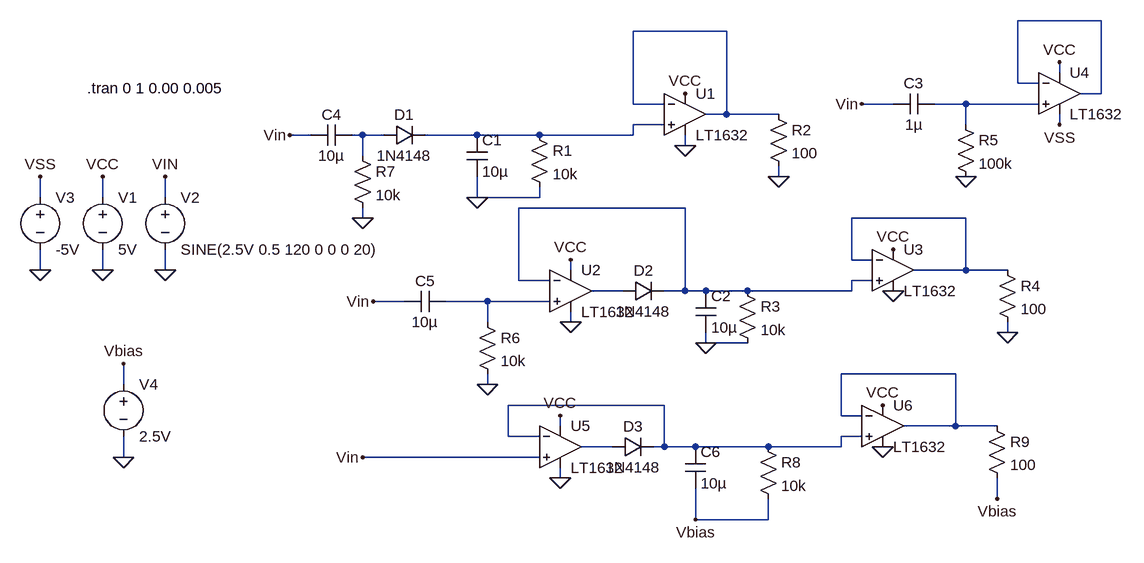
[diagram p0: schematic PeakDetect.asc]
PeakDetect.asc, the LTspice schematic file:
Version 4
SHEET 1 1336 812
WIRE 1296 -144 1168 -144
WIRE 720 -128 576 -128
WIRE 1232 -64 1232 -80
WIRE 1168 -48 1168 -144
WIRE 1200 -48 1168 -48
WIRE 1296 -32 1296 -144
WIRE 1296 -32 1264 -32
WIRE 576 -16 576 -128
WIRE 624 -16 576 -16
WIRE 976 -16 928 -16
WIRE 1088 -16 1040 -16
WIRE 1200 -16 1088 -16
WIRE 720 0 720 -128
WIRE 720 0 688 0
WIRE 800 0 720 0
WIRE 624 16 576 16
WIRE 1088 16 1088 -16
WIRE 1232 16 1232 0
WIRE 80 32 48 32
WIRE 160 32 144 32
WIRE 192 32 160 32
WIRE 336 32 256 32
WIRE 432 32 336 32
WIRE 576 32 576 16
WIRE 576 32 432 32
WIRE 656 48 656 32
WIRE 160 64 160 32
WIRE 800 96 800 80
WIRE -336 128 -336 96
WIRE -240 128 -240 96
WIRE -144 128 -144 96
WIRE 336 128 336 96
WIRE 432 128 432 112
WIRE 432 128 336 128
WIRE 656 144 400 144
WIRE 160 160 160 144
WIRE 1088 160 912 160
WIRE 912 224 912 160
WIRE 944 224 912 224
WIRE -336 240 -336 208
WIRE -240 240 -240 208
WIRE -144 240 -144 208
WIRE 480 240 480 224
WIRE 1088 240 1088 160
WIRE 1088 240 1008 240
WIRE 1152 240 1088 240
WIRE 400 256 400 144
WIRE 448 256 400 256
WIRE 944 256 912 256
WIRE 560 272 512 272
WIRE 656 272 656 144
WIRE 656 272 624 272
WIRE 688 272 656 272
WIRE 752 272 688 272
WIRE 912 272 912 256
WIRE 912 272 752 272
WIRE 224 288 176 288
WIRE 352 288 288 288
WIRE 448 288 352 288
WIRE 352 320 352 288
WIRE 480 320 480 304
WIRE 1152 336 1152 320
WIRE 688 352 688 336
WIRE 752 352 688 352
WIRE 1072 400 896 400
WIRE -208 416 -208 384
WIRE 352 416 352 400
WIRE 624 448 384 448
WIRE 896 464 896 400
WIRE 928 464 896 464
WIRE 464 480 464 464
WIRE 1072 480 1072 400
WIRE 1072 480 992 480
WIRE 1136 480 1072 480
WIRE 384 496 384 448
WIRE 432 496 384 496
WIRE 928 496 896 496
WIRE 544 512 496 512
WIRE 624 512 624 448
WIRE 624 512 608 512
WIRE 672 512 624 512
WIRE 784 512 672 512
WIRE 896 512 896 496
WIRE 896 512 784 512
WIRE -208 528 -208 496
WIRE 432 528 160 528
WIRE 464 560 464 544
WIRE 1136 592 1136 560
WIRE 672 624 672 576
WIRE 784 624 784 592
WIRE 784 624 672 624
FLAG -144 240 0
FLAG -240 240 0
FLAG -144 96 VIN
FLAG -240 96 VCC
FLAG -336 240 0
FLAG -336 96 VSS
FLAG 336 128 0
FLAG 800 96 0
FLAG 656 48 0
FLAG 656 -32 VCC
FLAG 480 320 0
FLAG 480 224 VCC
FLAG 688 352 0
FLAG 1152 336 0
FLAG 976 272 0
FLAG 976 208 VCC
FLAG 48 32 Vin
FLAG 176 288 Vin
FLAG 1232 -80 VCC
FLAG 1232 16 VSS
FLAG 928 -16 Vin
FLAG 1088 96 0
FLAG 352 416 0
FLAG 160 160 0
FLAG 464 560 0
FLAG 464 464 VCC
FLAG 960 512 0
FLAG 960 448 VCC
FLAG 160 528 Vin
FLAG 1136 592 Vbias
FLAG -208 528 0
FLAG -208 384 Vbias
FLAG 672 624 Vbias
SYMBOL voltage -240 112 R0
WINDOW 123 0 0 Left 0
WINDOW 39 0 0 Left 0
SYMATTR InstName V1
SYMATTR Value 5V
SYMBOL voltage -144 112 R0
WINDOW 123 0 0 Left 0
WINDOW 39 0 0 Left 0
SYMATTR InstName V2
SYMATTR Value SINE(2.5V 0.5 120 0 0 0 20)
SYMBOL voltage -336 112 R0
WINDOW 123 0 0 Left 0
WINDOW 39 0 0 Left 0
SYMATTR InstName V3
SYMATTR Value -5V
SYMBOL diode 192 48 R270
WINDOW 0 32 32 VTop 2
WINDOW 3 0 32 VBottom 2
SYMATTR InstName D1
SYMATTR Value 1N4148
SYMBOL cap 320 32 R0
SYMATTR InstName C1
SYMATTR Value 10µ
SYMBOL res 416 16 R0
SYMATTR InstName R1
SYMATTR Value 10k
SYMBOL Opamps\\LT1632 656 -64 R0
SYMATTR InstName U1
SYMBOL res 784 -16 R0
SYMATTR InstName R2
SYMATTR Value 100
SYMBOL diode 560 288 R270
WINDOW 0 32 32 VTop 2
WINDOW 3 0 32 VBottom 2
SYMATTR InstName D2
SYMATTR Value 1N4148
SYMBOL cap 672 272 R0
SYMATTR InstName C2
SYMATTR Value 10µ
SYMBOL res 736 256 R0
SYMATTR InstName R3
SYMATTR Value 10k
SYMBOL Opamps\\LT1632 480 208 R0
SYMATTR InstName U2
SYMBOL Opamps\\LT1632 976 176 R0
SYMATTR InstName U3
SYMBOL res 1136 224 R0
SYMATTR InstName R4
SYMATTR Value 100
SYMBOL cap 144 16 R90
WINDOW 0 0 32 VBottom 2
WINDOW 3 32 32 VTop 2
SYMATTR InstName C4
SYMATTR Value 10µ
SYMBOL Opamps\\LT1632 1232 -96 R0
SYMATTR InstName U4
SYMBOL cap 1040 -32 R90
WINDOW 0 0 32 VBottom 2
WINDOW 3 32 32 VTop 2
SYMATTR InstName C3
SYMATTR Value 1µ
SYMBOL res 1072 0 R0
SYMATTR InstName R5
SYMATTR Value 100k
SYMBOL cap 288 272 R90
WINDOW 0 0 32 VBottom 2
WINDOW 3 32 32 VTop 2
SYMATTR InstName C5
SYMATTR Value 10µ
SYMBOL res 336 304 R0
SYMATTR InstName R6
SYMATTR Value 10k
SYMBOL res 144 48 R0
SYMATTR InstName R7
SYMATTR Value 10k
SYMBOL diode 544 528 R270
WINDOW 0 32 32 VTop 2
WINDOW 3 0 32 VBottom 2
SYMATTR InstName D3
SYMATTR Value 1N4148
SYMBOL cap 656 512 R0
SYMATTR InstName C6
SYMATTR Value 10µ
SYMBOL Opamps\\LT1632 464 448 R0
SYMATTR InstName U5
SYMBOL Opamps\\LT1632 960 416 R0
SYMATTR InstName U6
SYMBOL res 1120 464 R0
SYMATTR InstName R9
SYMATTR Value 100
SYMBOL voltage -208 400 R0
WINDOW 123 0 0 Left 0
WINDOW 39 0 0 Left 0
SYMATTR InstName V4
SYMATTR Value 2.5V
SYMBOL res 768 496 R0
SYMATTR InstName R8
SYMATTR Value 10k
TEXT -264 -40 Left 2 !.tran 0 1 0.00 0.005

The netlist it stands for:
* PeakDetect.asc
V1 VCC 0 5V
V2 VIN 0 SINE(2.5V 0.5 120 0 0 0 20)
V3 VSS 0 -5V
D1 N005 N004 1N4148
C1 N004 0 10µ
R1 N004 0 10k
XU1 N004 N002 VCC 0 N002 LT1632  ; pins In+ In- V+ V- OUT
R2 N002 0 100
D2 N008 N006 1N4148
C2 N006 0 10µ
R3 N006 0 10k
XU2 N009 N006 VCC 0 N008 LT1632  ; pins In+ In- V+ V- OUT
XU3 N006 N007 VCC 0 N007 LT1632  ; pins In+ In- V+ V- OUT
R4 N007 0 100
C4 N005 VIN 10µ
XU4 N003 N001 VCC VSS N001 LT1632  ; pins In+ In- V+ V- OUT
C3 N003 VIN 1µ
R5 N003 0 100k
C5 N009 VIN 10µ
R6 N009 0 10k
R7 N005 0 10k
D3 N012 N011 1N4148
C6 N011 Vbias 10µ
XU5 VIN N011 VCC 0 N012 LT1632  ; pins In+ In- V+ V- OUT
XU6 N011 N010 VCC 0 N010 LT1632  ; pins In+ In- V+ V- OUT
R9 N010 Vbias 100
V4 Vbias 0 2.5V
R8 N011 Vbias 10k
.model D D
.lib standard.dio
.tran 0 1 0.00 0.005
.lib LTC.lib
.backanno
.end